# Altium schematic sheet ESP32.SchDoc
size A4
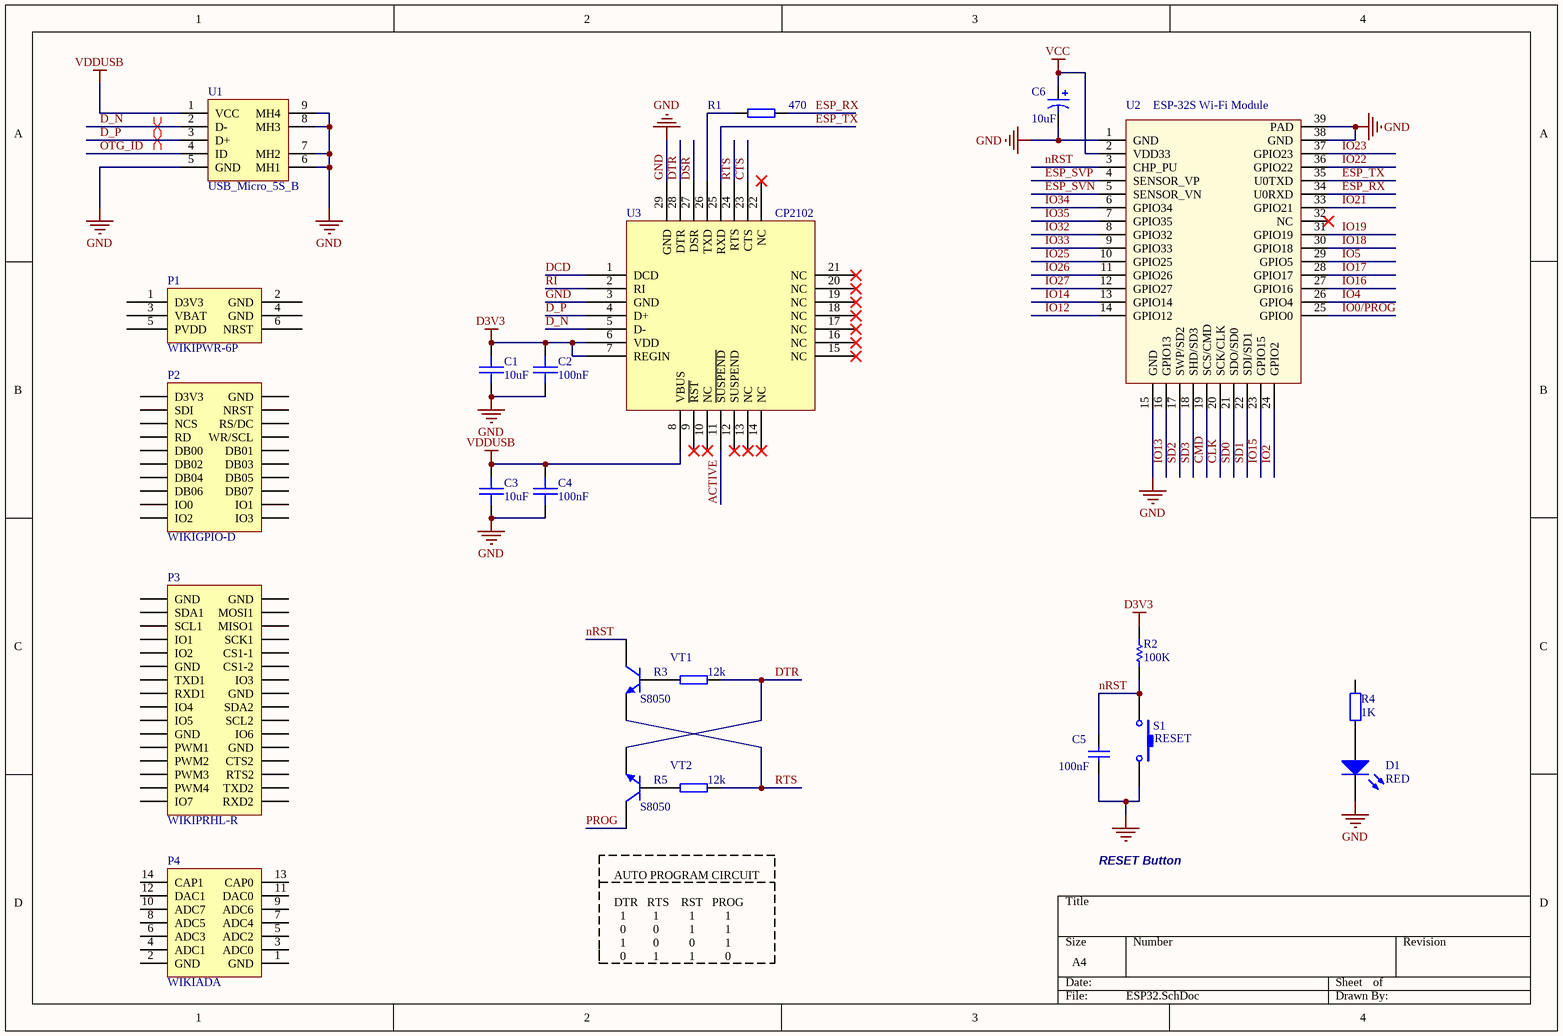
[diagram p0: ESP32.SchDoc]

## Parts
C1  10uF  [C0603L]
C2  100nF  [C0603L]
C3  10uF  [C0603L]
C4  100nF  [C0603L]
C5  100nF  [C0603L]
C6  10uF  [1210]
D1  RED  [SMT_LED_0603]
P1  WIKIPWR-6P  [WIKIPWR-6P]
P2  WIKIGPIO-D  [WIKIGPIO-U]
P3  WIKIPRHL-R  [WIKIPRHL-R]
P4  WIKIADA  [WIKIADA]
R1  470  [R0603]
R2  100K  [R0603]
R3  12k  [R0603]
R4  1K  [R0603]
R5  12k  [R0603]
S1  RESET  [KEY-2x4-SMD]
U1  USB_Micro_5S_B  [USB_MICRO_5S_B]
U2  ESP-32S Wi-Fi Module  [ESP-32S]
U3  CP2102  [QFN28]
VT1  S8050  [SMT_TRIODE_NPN]
VT2  S8050  [SMT_TRIODE_NPN]

## Nets
D3V3: C1.1 C2.1 R2.2 U3.6(VDD) U3.7(REGIN)
GND: C1.2 C2.2 C3.2 C4.2 C5.1 C6.2 D1.2(K) S1.1 U1.5(GND) U1.6(MH1) U1.7(MH2) U1.8(MH3) U1.9(MH4) U2.1(GND) U2.15(GND) U2.38(GND) U2.39(PAD) U3.3(GND) U3.29(GND)
VCC: C6.1 U2.2(VDD33)
VDDUSB: C3.1 C4.1 U1.1(VCC) U3.8(VBUS)
ACTIVE: U3.11(~{SUSPEND})
CLK: U2.20(SCK/CLK)
CMD: U2.19(SCS/CMD)
CTS: U3.23(CTS)
D_N: U1.2(D-) U3.5(D-)
D_P: U1.3(D+) U3.4(D+)
DCD: U3.1(DCD)
DSR: U3.27(DSR)
DTR: R3.2 U3.28(DTR) VT2.2(E)
ESP_RX: R1.2 U2.34(U0RXD)
ESP_SVN: U2.5(SENSOR_VN)
ESP_SVP: U2.4(SENSOR_VP)
ESP_TX: U2.35(U0TXD) U3.25(RXD)
IO0/PROG: U2.25(GPIO0)
IO2: U2.24(GPIO2)
IO4: U2.26(GPIO4)
IO5: U2.29(GPIO5)
IO12: U2.14(GPIO12)
IO13: U2.16(GPIO13)
IO14: U2.13(GPIO14)
IO15: U2.23(GPIO15)
IO16: U2.27(GPIO16)
IO17: U2.28(GPIO17)
IO18: U2.30(GPIO18)
IO19: U2.31(GPIO19)
IO21: U2.33(GPIO21)
IO22: U2.36(GPIO22)
IO23: U2.37(GPIO23)
IO25: U2.10(GPIO25)
IO26: U2.11(GPIO26)
IO27: U2.12(GPIO27)
IO32: U2.8(GPIO32)
IO33: U2.9(GPIO33)
IO34: U2.6(GPIO34)
IO35: U2.7(GPIO35)
nRST: C5.2 R2.1 S1.2 U2.3(CHP_PU) VT1.3(C)
OTG_ID: U1.4(ID)
PROG: VT2.3(C)
RI: U3.2(RI)
RTS: R5.2 U3.24(RTS) VT1.2(E)
SD0: U2.21(SDO/SD0)
SD1: U2.22(SDI/SD1)
SD2: U2.17(SWP/SD2)
SD3: U2.18(SHD/SD3)
NetD1_1: D1.1(A) R4.1
NetR1_1: R1.1 U3.26(TXD)
NetR3_1: R3.1 VT1.1(B)
NetR5_1: R5.1 VT2.1(B)

Not connected (* = marked no-connect by the designer): P1 1(D3V3) 2(GND) 3(VBAT) 4(GND) 5(PVDD) 6(NRST); P2 1(D3V3) 2(GND) 3(SDI) 4(NRST) 5(NCS) 6(RS/DC) 7(RD) 8(WR/SCL) 9(DB00) 10(DB01) 11(DB02) 12(DB03) 13(DB04) 14(DB05) 15(DB06) 16(DB07) 17(IO0) 18(IO1) 19(IO2) 20(IO3); P3 1(GND) 2(GND) 3(SDA1) 4(MOSI1) 5(SCL1) 6(MISO1) 7(IO1) 8(SCK1) 9(IO2) 10(CS1-1) 11(GND) 12(CS1-2) 13(TXD1) 14(IO3) 15(RXD1) 16(GND) 17(IO4) 18(SDA2) 19(IO5) 20(SCL2) 21(GND) 22(IO6) 23(PWM1) 24(GND) 25(PWM2) 26(CTS2) 27(PWM3) 28(RTS2) 29(PWM4) 30(TXD2) 31(IO7) 32(RXD2); P4 1(GND) 2(GND) 3(ADC0) 4(ADC1) 5(ADC2) 6(ADC3) 7(ADC4) 8(ADC5) 9(ADC6) 10(ADC7) 11(DAC0) 12(DAC1) 13(CAP0) 14(CAP1); R4 2; U2 32(NC)*; U3 9(~{RST})* 10(NC)* 12(SUSPEND)* 13(NC)* 14(NC)* 15(NC)* 16(NC)* 17(NC)* 18(NC)* 19(NC)* 20(NC)* 21(NC)* 22(NC)*

## Layout directives
differential pair: D_N, D_P

## Notes on the sheet
- RESET Button
- AUTO PROGRAM CIRCUIT
  DTR   RTS    RST   PROG
  1         1          1          1
  0         0          1          1
  1         0          0          1
  0         1          1          0

## Library data of the parts
C1-C4 = SMT_C_0402: Surface mount capacitor 0402
C5 = CAP: Capacitor; Published: 8-Jun-2000; Revision: July-2002: Re-released for DXP Platform.; Publisher: Altium Limited; Value: 100nF
C6 = Cap Pol2: Polarized Capacitor (Axial); Published: 8-Jun-2000; LatestRevisionDate: 17-Jul-2002; LatestRevisionNote: Re-released for DXP Platform.; PackageReference: POLAR0.8; Publisher: Altium Limited; Value: 10uF
D1 = LED0: Typical INFRARED GaAs LED; Published: 8-Jun-2000; LatestRevisionDate: 08-Jul-2005; LatestRevisionNote: Mech Layer 1 removed.; PackageReference: LED-0; Publisher: Altium Limited
P1 = WIKIPWR-6P: PWR HDR
P2 = WIKIGPIO-D: Header, 9-Pin, Dual row; LatestRevisionDate: 17-Jul-2002; LatestRevisionNote: Re-released for DXP Platform.; Publisher: Altium Limited
P3 = WIKIPRHL-R: Header, 16-Pin, Dual row; LatestRevisionDate: 17-Jul-2002; LatestRevisionNote: Re-released for DXP Platform.; Publisher: Altium Limited
P4 = WIKIADA: Header, 14-Pin, Dual row
R1 R3 R5 = SMT_R_0402: Surface mount resistor 0402
R2 = res1: Resistor; Fitted: NO; Published: 8-Jun-2000; Revision: July-2002: Re-released for DXP Platform.; Publisher: Altium Limited; Value: 100K
R4 = Res2: Resistor; Published: 8-Jun-2000; LatestRevisionDate: 17-Jul-2002; LatestRevisionNote: Re-released for DXP Platform.; PackageReference: AXIAL-0.4; Publisher: Altium Limited; Value: 1K
S1 = SW-PB: Switch; Published: 24-Mar-1999; LatestRevisionDate: 17-Jul-2002; LatestRevisionNote: Re-released for DXP Platform.; PackageReference: SPST-2; Publisher: Altium Limited
U1 = USB_Micro_5S_B: USB micro female SMT with 4 fixed foot
U2 = ESP-32S
VT1 VT2 = SMT_TRIODE_NPN: Surface mount NPN transistor, package SOT-23